# Altium schematic sheet 05_ZYNQ_Config.SchDoc
size A3; SheetNumber: 5; SheetTotal: 9
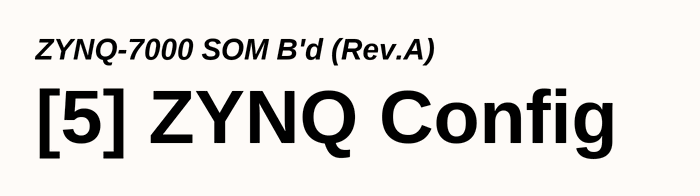
[diagram p0: 05_ZYNQ_Config.SchDoc]

## Notes on the sheet
- ZYNQ-7000 SOM B'd (Rev.A)
- [5] ZYNQ Config
- Title
- Rev
- Doc
- Sheet #
- of
- Author
- This document is copyright of ArkX and shall not be revealed, produced, copied, in whole or in part,
- Date
- nor used for any purpose other than submitted.